# EasyEDA Pro project PCB_ClaySight_MK1.epro

# Board PCB_ClaySight
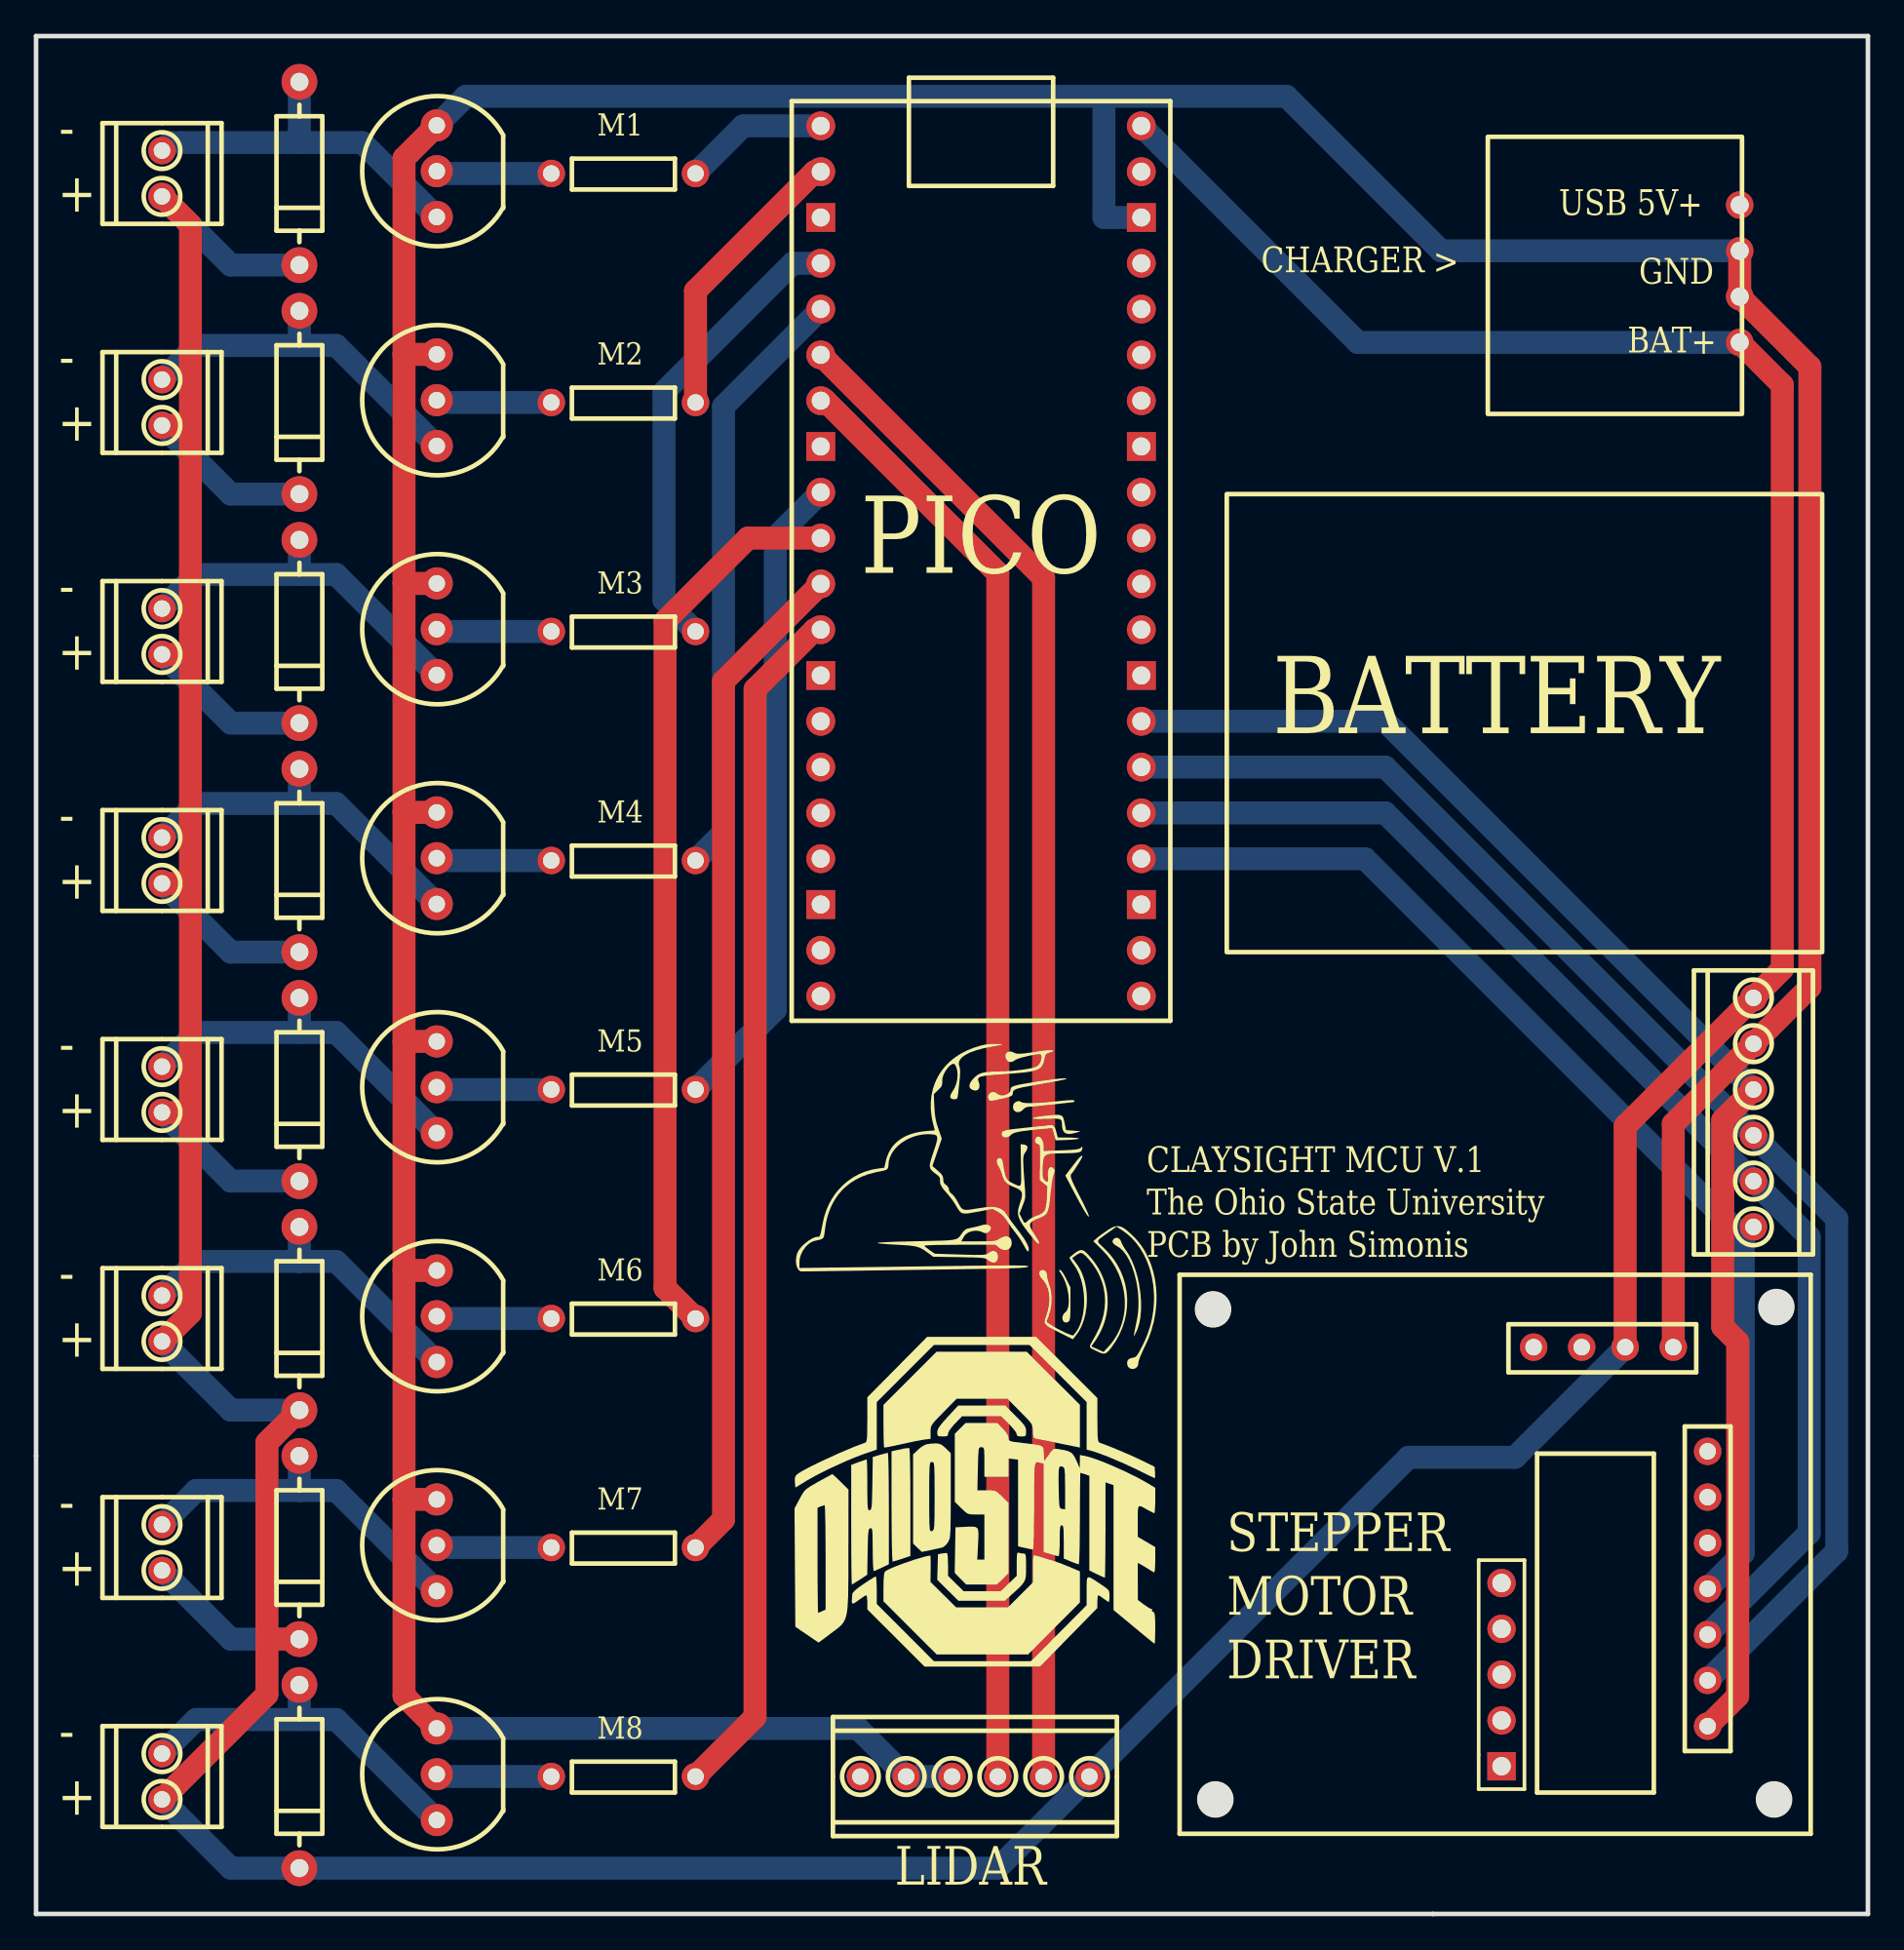
[diagram p0: board, top side]
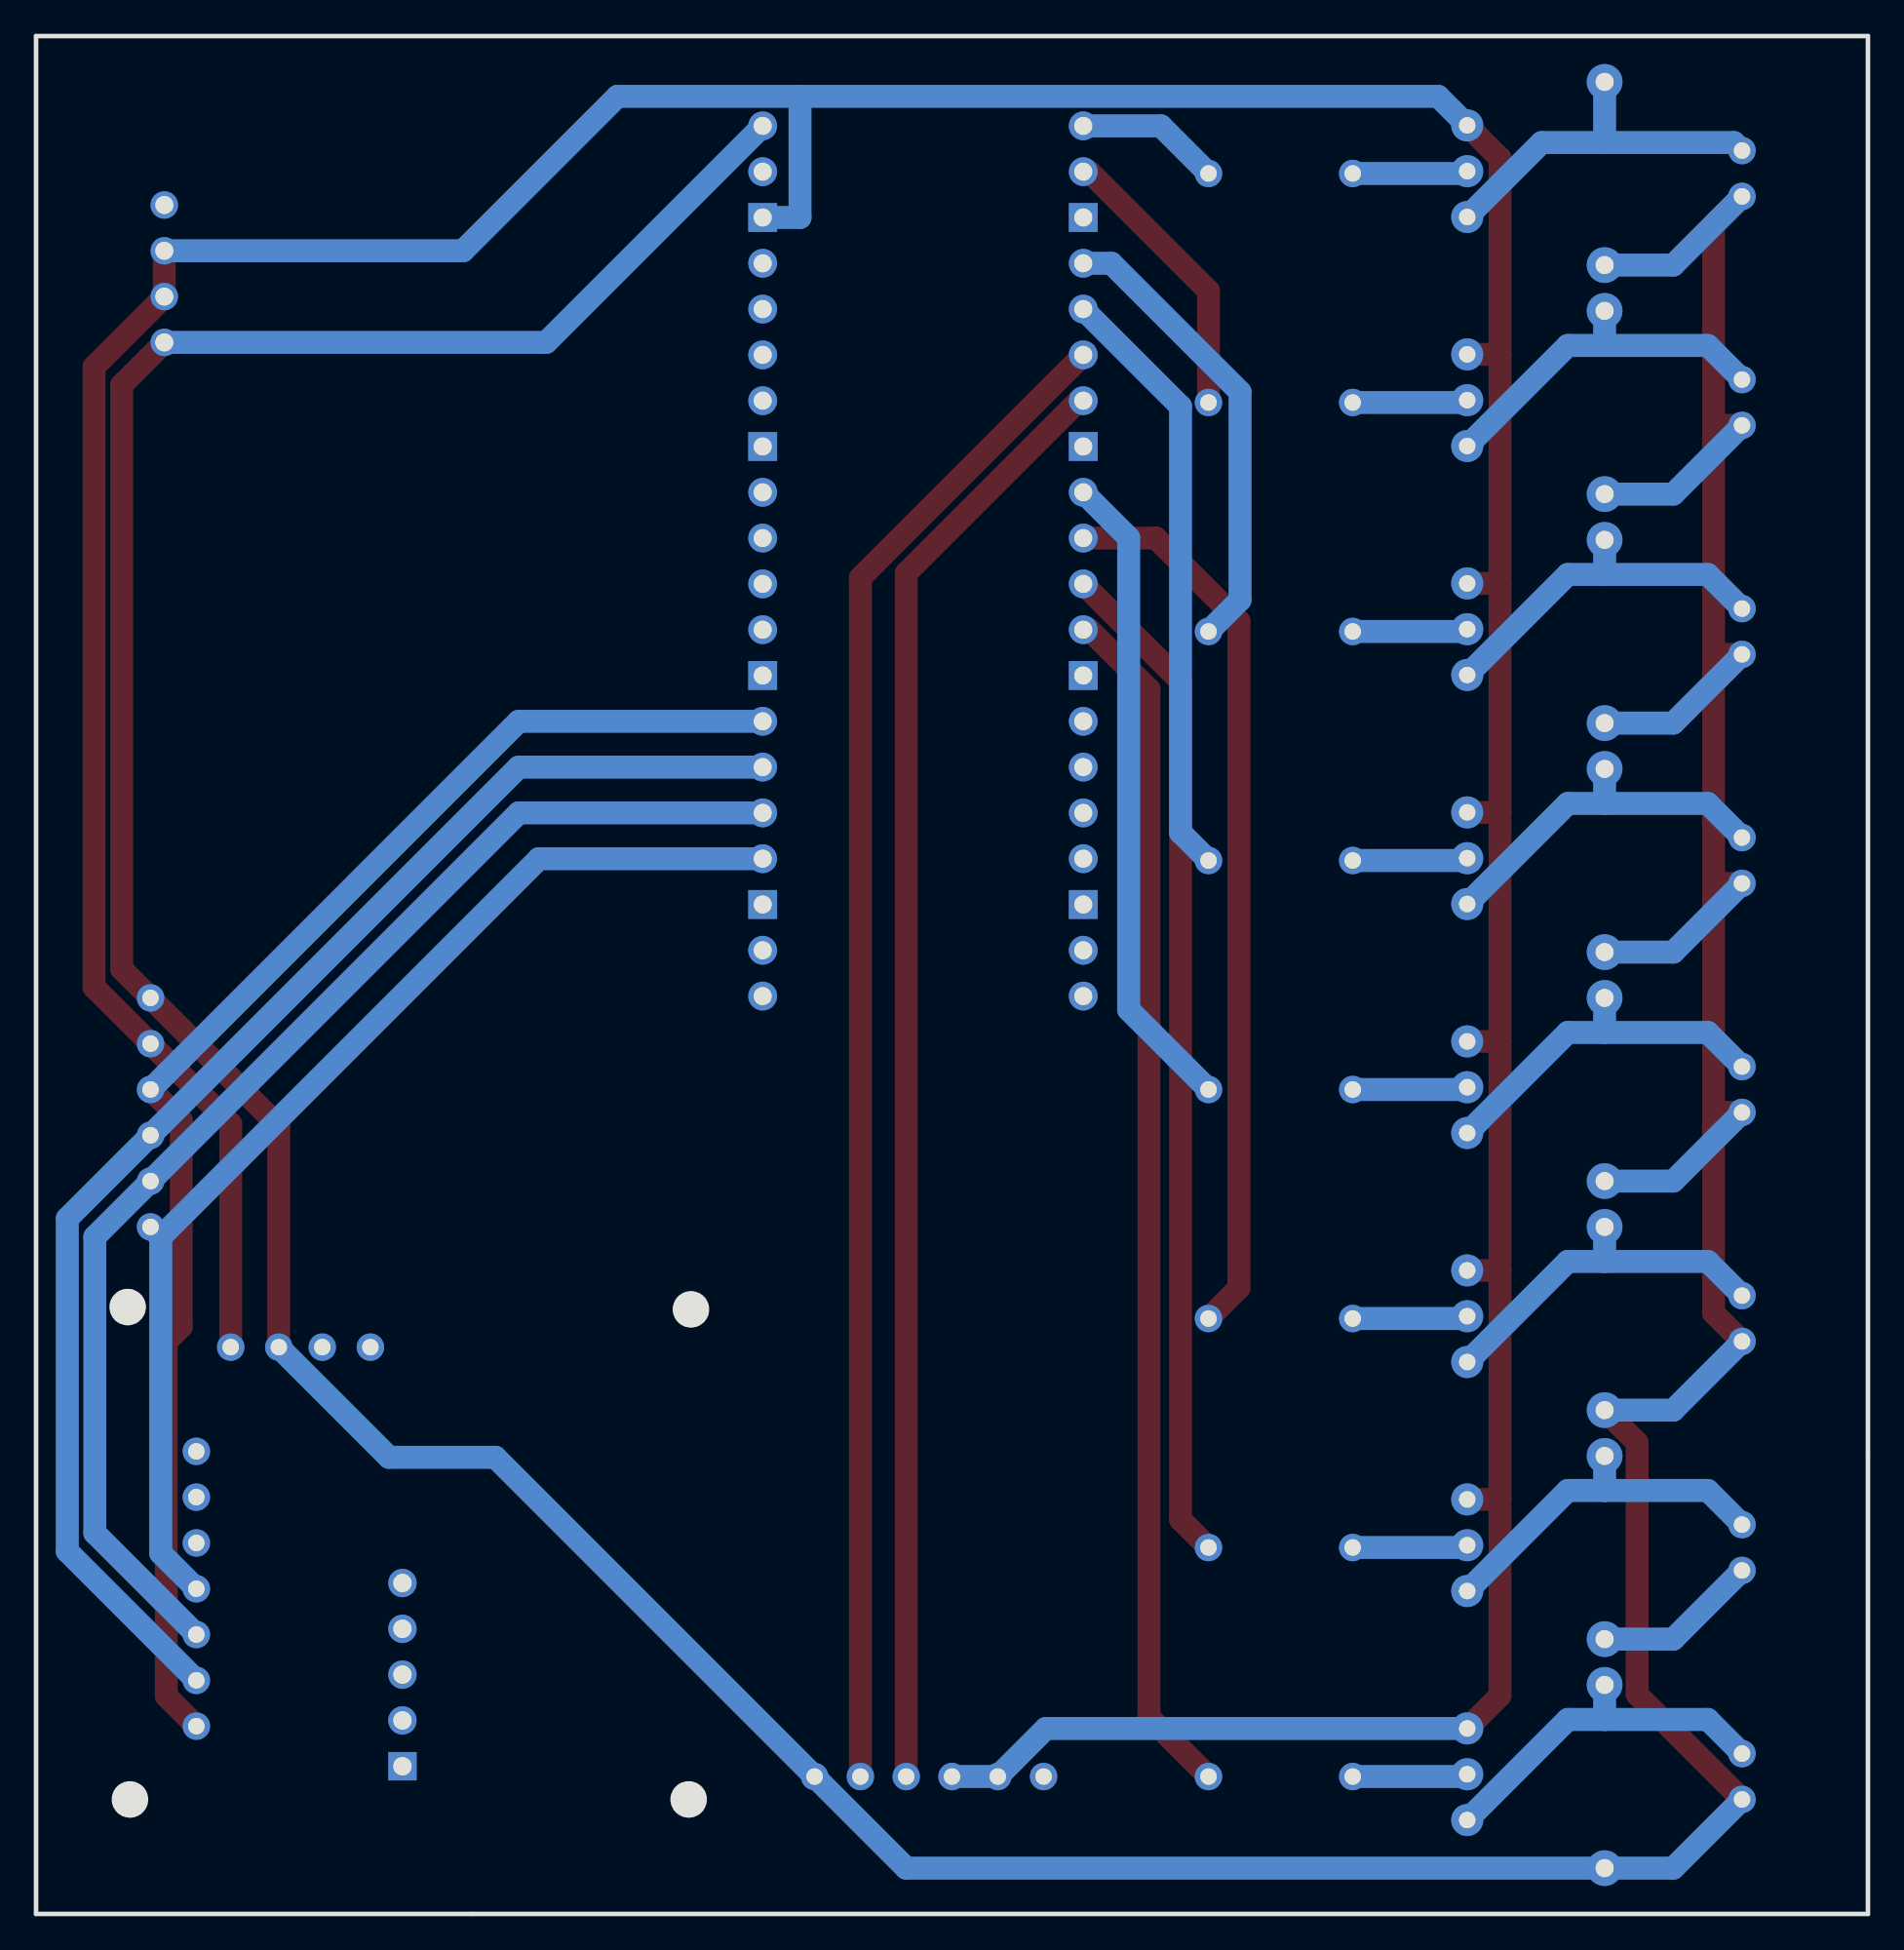
[diagram p1: board, bottom side, seen from below]

Outline 101.6 x 104.14 mm; copper layers: Top Layer, Bottom Layer. Coordinates in mm from the lower left corner of the outline.
Outline path: 0,104.14 101.6,104.14 101.6,0 0,0 0,104.14

## Design rules (mm)
spacing Default (default): track to track 0.152, other pairs 0 to 0.152
track width Default (default): min 1.27, default 1.27, max 25.4
via Default (default): diameter min 0.61, default 0.61, max 100.025; hole min 0.305, default 0.305, max 59.995

## Placement (name value [footprint] x y rotation side)
D1  -  [DIODE-1N4001]  14.61 96.52 270 top
D2  -  [DIODE-1N4001]  14.61 83.82 270 top
D3  -  [DIODE-1N4001]  14.61 71.12 270 top
D4  -  [DIODE-1N4001]  14.61 58.42 270 top
D13  -  [DIODE-1N4001]  14.61 45.72 270 top
D14  -  [DIODE-1N4001]  14.61 33.02 270 top
D15  -  [DIODE-1N4001]  14.61 20.32 270 top
D16  -  [DIODE-1N4001]  14.61 7.62 270 top
M1  -  [RESISTOR]  28.58 96.52 0 top
M2  -  [RESISTOR]  28.58 83.82 0 top
M3  -  [RESISTOR]  28.58 71.12 0 top
M4  -  [RESISTOR]  28.58 58.42 0 top
M5  -  [RESISTOR]  28.58 45.72 0 top
M6  -  [RESISTOR]  28.58 33.02 0 top
M7  -  [RESISTOR]  28.58 20.32 0 top
M8  -  [RESISTOR]  28.58 7.62 0 top
NOREF  -  [Pad_e580]  94.49 92.23 0 top
NOREF#2  -  [Pad_e579]  94.49 94.77 0 top
NOREF#3  -  [Pad_e582]  94.49 87.15 0 top
NOREF#4  -  [Pad_e581]  94.49 89.69 0 top
U1  Raspberry Pi Pico W  [RASPBERRY PI PICO/ RASPBERRY PI PICO W]  41.91 49.53 0 top
U2  transistorcustom1  [TRANSISTORCUSTOM]  22.23 7.62 180 top
U3  transistorcustom1  [TRANSISTORCUSTOM]  22.23 20.32 180 top
U4  transistorcustom1  [TRANSISTORCUSTOM]  22.23 33.02 180 top
U5  transistorcustom1  [TRANSISTORCUSTOM]  22.23 45.72 180 top
U6  transistorcustom1  [TRANSISTORCUSTOM]  22.23 58.42 180 top
U7  transistorcustom1  [TRANSISTORCUSTOM]  22.23 71.12 180 top
U8  transistorcustom1  [TRANSISTORCUSTOM]  22.23 83.82 180 top
U9  transistorcustom1  [TRANSISTORCUSTOM]  22.23 96.52 180 top
U10  -  [SCREW-TERMINAL-6P-2.54MM]  58.42 7.62 270 top
U14  -  [SCREW-TERMINAL-2P-2.54MM]  6.98 97.79 0 top
U15  -  [SCREW-TERMINAL-2P-2.54MM]  6.98 85.09 0 top
U16  -  [SCREW-TERMINAL-2P-2.54MM]  6.98 72.39 0 top
U17  -  [SCREW-TERMINAL-2P-2.54MM]  6.98 59.69 0 top
U18  -  [SCREW-TERMINAL-2P-2.54MM]  6.98 46.99 0 top
U19  -  [SCREW-TERMINAL-2P-2.54MM]  6.98 34.29 0 top
U20  -  [SCREW-TERMINAL-2P-2.54MM]  6.98 21.59 0 top
U21  -  [SCREW-TERMINAL-2P-2.54MM]  6.98 8.89 0 top
U29  -  [ULN2003-STEPPER-MOTOR-DRIVER]  98.42 4.44 180 top
U30  -  [SCREW-TERMINAL-6P-2.54MM]  95.25 38.1 180 top

## Footprints (pads in the part's own frame, mm; a bottom-side part is the same pattern mirrored in y, then rotated)
DIODE-1N4001
  round 1.981 hole 1x1: A(-5.08,0) C(5.08,0)
Pad_e579
  round 1.524 hole 1: 1(0,0)
Pad_e580
  round 1.524 hole 1: 1(0,0)
Pad_e581
  round 1.524 hole 1: 1(0,0)
Pad_e582
  round 1.524 hole 1: 1(0,0)
RASPBERRY PI PICO/ RASPBERRY PI PICO W
  round 1.6 hole 1: 1(1.61,49.63) 2(1.61,47.09) 4(1.61,42.01) 5(1.61,39.469) 6(1.61,36.929) 7(1.61,34.389) 9(1.61,29.309) 10(1.61,26.77) 11(1.61,24.23) 12(1.61,21.689) 14(1.61,16.61) 15(1.61,14.07) 16(1.61,11.53) 17(1.61,8.99) 19(1.61,3.91) 20(1.61,1.37) 21(19.39,1.37) 22(19.39,3.91) 24(19.39,8.99) 25(19.39,11.53) 26(19.39,14.07) 27(19.39,16.61) 29(19.39,21.689) 30(19.39,24.23) 31(19.39,26.77) 32(19.39,29.309) 34(19.39,34.389) 35(19.39,36.929) 36(19.39,39.469) 37(19.39,42.01) 39(19.39,47.09) 40(19.39,49.63)
  rect 1.6x1.6 hole 1: 3(1.61,44.55) 8(1.61,31.85) 13(1.61,19.15) 18(1.61,6.45) 23(19.39,6.45) 28(19.39,19.15) 33(19.39,31.85) 38(19.39,44.55)
RESISTOR
  round 1.524 hole 0.914: 1(0,0) 2(8,0)
SCREW-TERMINAL-2P-2.54MM
  round 1.524 hole 0.914: 1(0,0) 2(0,-2.54)
SCREW-TERMINAL-6P-2.54MM
  round 1.524 hole 0.914: 1(0,0) 2(0,-2.54) 3(0,-5.08) 4(0,-7.62) 5(0,-10.16) 6(0,-12.7)
TRANSISTORCUSTOM
  round 1.778 hole 0.914: 19(0,-2.667) 20(0,-0.127) 21(0,2.413)
ULN2003-STEPPER-MOTOR-DRIVER
  round 1.524 hole 0.914: 1(5.715,-5.969) 2(5.715,-8.509) 3(5.715,-11.049) 4(5.715,-13.589) 5(5.715,-16.129) 6(5.715,-18.669) 7(5.715,-21.209) 8(7.62,-26.988) 9(10.287,-26.988) 10(12.7,-26.988) 11(15.367,-26.988)
  round 1.575 hole 1.02: 12(17.145,-13.906) 13(17.145,-11.367) 15(17.145,-6.287) 17(17.145,-8.826)
  rect 1.575x1.575 hole 1.02: 16(17.145,-3.747)

## Nets
VCC: D1.C D2.C D3.C D4.C D13.C D14.C D15.C D16.C NOREF#3.1 U1.40 U10.1 U14.2 U15.2 U16.2 U17.2 U18.2 U19.2 U20.2 U21.2 U29.9 U30.6
N$15664: NOREF.1 NOREF#4.1 U1.38 U2.19 U3.19 U4.19 U5.19 U6.19 U7.19 U8.19 U9.19 U10.4 U10.5 U29.8 U30.5
U1_1: M1.2 U1.1
U1_2: M2.2 U1.2
U1_3: U1.3
U1_4: M3.2 U1.4
U1_5: M4.2 U1.5
U1_6: U1.6 U10.2
U1_7: U1.7 U10.3
U1_8: U1.8
U1_9: M5.2 U1.9
U1_10: M6.2 U1.10
U1_11: M7.2 U1.11
U1_12: M8.2 U1.12
U1_13: U1.13
U1_14: U1.14
U1_15: U1.15
U1_16: U1.16
U1_17: U1.17
U1_18: U1.18
U1_19: U1.19
U1_20: U1.20
U1_21: U1.21
U1_22: U1.22
U1_23: U1.23
U1_24: U1.24 U29.4 U30.1
U1_25: U1.25 U29.3 U30.2
U1_26: U1.26 U29.2 U30.3
U1_27: U1.27 U29.1 U30.4
U1_28: U1.28
U1_29: U1.29
U1_30: U1.30
U1_31: U1.31
U1_32: U1.32
U1_33: U1.33
U1_34: U1.34
U1_35: U1.35
U1_36: U1.36
U1_37: U1.37
U1_39: U1.39
U2_20: M8.1 U2.20
U2_21: D16.A U2.21 U21.1
U3_20: M7.1 U3.20
U3_21: D15.A U3.21 U20.1
U4_20: M6.1 U4.20
U4_21: D14.A U4.21 U19.1
U5_20: M5.1 U5.20
U5_21: D13.A U5.21 U18.1
U6_20: M4.1 U6.20
U6_21: D4.A U6.21 U17.1
U7_20: M3.1 U7.20
U7_21: D3.A U7.21 U16.1
U8_20: M2.1 U8.20
U8_21: D2.A U8.21 U15.1
U9_20: M1.1 U9.20
U9_21: D1.A U9.21 U14.1
U10_6: U10.6

Pads without a net: NOREF#2 1; U29 5 6 7 10 11 12 13 15 16 17

## Routing (per net, layer and track width the routed paths; a pad name or vN(x,y) marks a point on that pad's centre or on a via; arc(x,y) is an arc through that point)
VCC: length 355.2
  Top Layer w1.27: 8.56,69.85 8.56,82.55 ; 8.56,69.85 U16.2 ; 8.56,69.85 8.56,57.15 ; 8.56,82.55 U15.2 ; 8.56,82.55 8.56,93.68 U14.2 ; D14.C 12.8,26.14 12.8,15.24 ; 8.56,57.15 U17.2 ; 8.56,57.15 8.56,44.45 ; 8.56,44.45 8.56,33.32 U19.2 ; 8.56,44.45 U18.2 ; NOREF#3.1 96.85,84.79 96.85,52.4 U30.6 88.14,43.69 U29.9 ; 12.8,15.24 12.8,12.17 U21.2 ; 12.8,15.24 D15.C
  Bottom Layer w1.27: D2.C 10.8,78.74 U15.2 ; D3.C 10.8,66.04 U16.2 ; D13.C 10.8,40.64 U18.2 ; U17.2 10.8,53.34 D4.C ; U29.9 82.03,25.32 76.12,25.32 U10.1 53.34,2.54 D16.C 10.8,2.54 U21.2 ; U20.2 10.8,15.24 D15.C ; U14.2 10.8,91.44 D1.C ; D14.C 10.8,27.94 U19.2 ; U1.40 73.31,87.15 NOREF#3.1
N$15664: length 281.8
  Top Layer w1.27: 20.41,35.69 20.41,22.99 ; 20.41,35.69 20.41,48.39 ; 20.41,35.69 22.23,35.69 ; 20.41,22.99 20.41,12.1 U2.19 ; 20.41,22.99 U3.19 ; 20.41,86.49 20.41,97.37 U9.19 ; 20.41,86.49 20.41,73.79 ; 20.41,86.49 U8.19 ; 20.41,73.79 22.23,73.79 ; 20.41,73.79 20.41,61.09 ; NOREF.1 NOREF#4.1 98.38,85.8 98.38,51.39 U30.5 90.8,43.81 U29.8 ; 20.41,48.39 20.41,61.09 ; 20.41,48.39 22.23,48.39 ; 20.41,61.09 22.23,61.09
  Bottom Layer w1.27: 59.23,100.8 59.23,94.08 U1.38 ; 59.23,100.8 23.84,100.8 U9.19 ; 59.23,100.8 69.35,100.8 77.92,92.23 NOREF.1 ; U2.19 45.59,10.29 U10.5 U10.4
U1_1: length 8
  Bottom Layer w1.27: U1.1 39.21,99.16 M1.2
U1_2: length 15.9
  Top Layer w1.27: U1.2 43.18,96.62 36.58,90.01 M2.2
U1_4: length 25.7
  Bottom Layer w1.27: M3.2 34.83,72.87 34.83,84.41 41.96,91.54 U1.4
U1_5: length 33.5
  Bottom Layer w1.27: M4.2 38.13,59.97 38.13,83.61 U1.5
U1_6: length 84
  Top Layer w1.27: U1.6 55.88,74.1 U10.2
U1_7: length 80.5
  Top Layer w1.27: U1.7 43.77,83.92 53.34,74.35 U10.3
U1_9: length 36
  Bottom Layer w1.27: M5.2 41,50.15 41,76.32 U1.9
U1_10: length 49.9
  Top Layer w1.27: M6.2 34.89,34.71 34.89,71.7 39.49,76.3 U1.10
U1_11: length 56.3
  Top Layer w1.27: M7.2 38.13,21.87 38.13,68.37 U1.11
U1_12: length 66.7
  Top Layer w1.27: U1.12 43.18,71.22 39.88,67.91 39.88,10.92 M8.2
U1_24: length 63.2
  Bottom Layer w1.27: 94.69,37.54 94.69,20.01 U29.4 ; 94.69,37.54 73.71,58.52 U1.24 ; 94.69,37.54 U30.1
U1_25: length 71.2
  Bottom Layer w1.27: U29.3 98.34,21.13 98.34,37.55 U30.2 74.83,61.06 U1.25
U1_26: length 77.5
  Bottom Layer w1.27: U29.2 99.87,20.11 99.87,38.56 U30.3 74.83,63.6 U1.26
U1_27: length 79.5
  Top Layer w1.27: U30.4 93.55,44.02 93.55,32.56 94.38,31.74 94.38,12.08 U29.1
  Bottom Layer w1.27: U30.4 74.83,66.14 U1.27
U2_20: length 6.4
  Bottom Layer w1.27: U2.20 22.35,7.62 M8.1
U2_21: length 20.3
  Bottom Layer w1.27: U21.1 8.88,10.78 14.61,10.78 ; 14.61,10.78 D16.A ; 14.61,10.78 16.65,10.78 U2.21
U3_20: length 6.4
  Bottom Layer w1.27: U3.20 22.35,20.32 M7.1
U3_21: length 20.3
  Bottom Layer w1.27: U20.1 8.88,23.48 14.61,23.48 ; 22.23,17.91 16.65,23.48 14.61,23.48 ; 14.61,23.48 D15.A
U4_20: length 6.4
  Bottom Layer w1.27: 22.23,33.15 22.35,33.02 M6.1
U4_21: length 20.3
  Bottom Layer w1.27: 14.61,36.18 16.65,36.18 22.23,30.61 ; 14.61,36.18 8.88,36.18 U19.1 ; 14.61,36.18 D14.A
U5_20: length 6.4
  Bottom Layer w1.27: U5.20 22.35,45.72 M5.1
U5_21: length 20.3
  Bottom Layer w1.27: 14.61,48.88 8.88,48.88 U18.1 ; 14.61,48.88 D13.A ; 14.61,48.88 16.65,48.88 22.23,43.31
U6_20: length 6.4
  Bottom Layer w1.27: U6.20 22.35,58.42 M4.1
U6_21: length 20.3
  Bottom Layer w1.27: 22.23,56.01 16.65,61.58 14.61,61.58 ; 14.61,61.58 D4.A ; 14.61,61.58 8.88,61.58 U17.1
U7_20: length 6.4
  Bottom Layer w1.27: 22.23,71.25 22.35,71.12 M3.1
U7_21: length 20.3
  Bottom Layer w1.27: 14.61,74.28 8.88,74.28 U16.1 ; 14.61,74.28 16.65,74.28 22.23,68.71 ; 14.61,74.28 D3.A
U8_20: length 6.4
  Bottom Layer w1.27: U8.20 22.35,83.82 M2.1
U8_21: length 20.3
  Bottom Layer w1.27: U15.1 8.88,86.98 14.61,86.98 ; U8.21 16.65,86.98 14.61,86.98 ; 14.61,86.98 D2.A
U9_20: length 6.4
  Bottom Layer w1.27: U9.20 22.35,96.52 M1.1
U9_21: length 20.5
  Bottom Layer w1.27: D1.A 14.61,98.24 ; 14.61,98.24 7.43,98.24 U14.1 ; 14.61,98.24 18.1,98.24 U9.21

## Text on the board
Top Silkscreen Layer: CLAYSIGHT MCU V.1 / The Ohio State University / PCB by John Simonis | CHARGER > | USB 5V+ | BAT+ | GND | STEPPER / MOTOR / DRIVER | - / + | LIDAR | PICO | BATTERY
